# EAGLE design at91sam7x-ek (EAGLE 4.11)
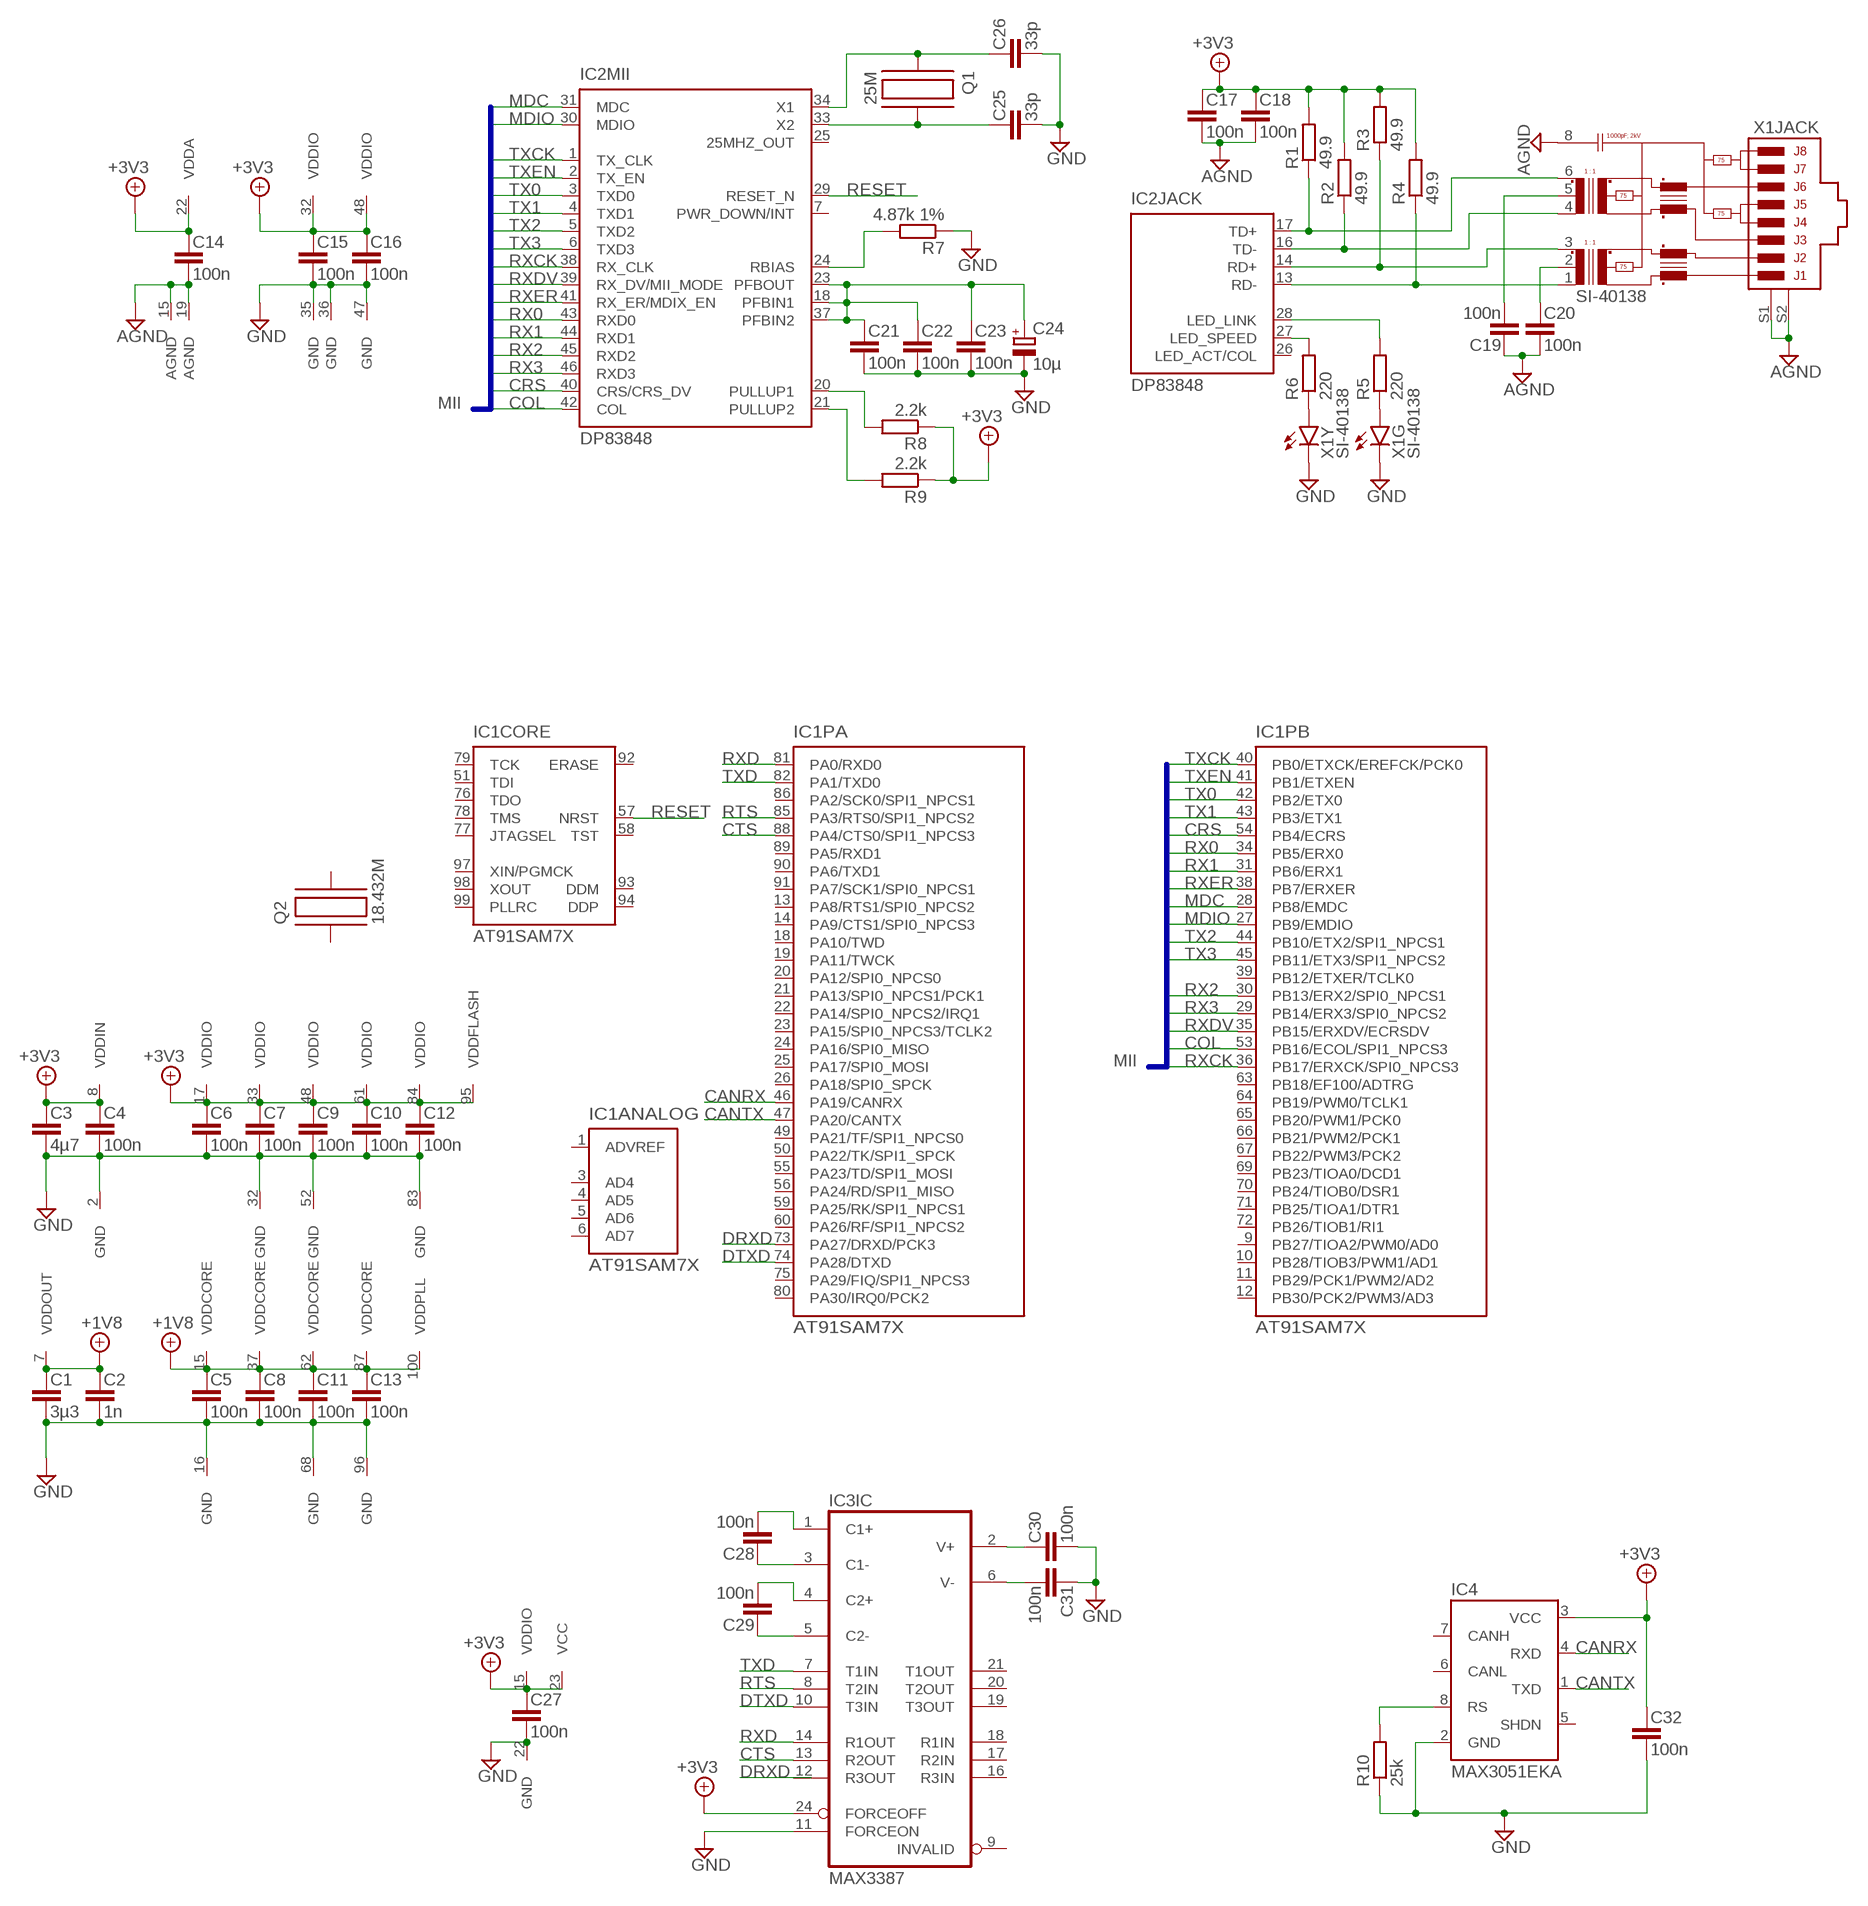
[diagram p0: schematic, sheet 1]

## Parts
C1  3µ3  C-EU  [C0603]
C2  1n  C-EU  [C0603]
C3  4µ7  C-EU  [C0603]
C4  100n  C-EU  [C0603]
C5  100n  C-EU  [C0603]
C6  100n  C-EU  [C0603]
C7  100n  C-EU  [C0603]
C8  100n  C-EU  [C0603]
C9  100n  C-EU  [C0603]
C10  100n  C-EU  [C0603]
C11  100n  C-EU  [C0603]
C12  100n  C-EU  [C0603]
C13  100n  C-EU  [C0603]
C14  100n  C-EU  [C0603]
C15  100n  C-EU  [C0603]
C16  100n  C-EU  [C0603]
C17  100n  C-EU  [C0603]
C18  100n  C-EU  [C0603]
C19  100n  C-EU  [C0603]
C20  100n  C-EU  [C0603]
C21  100n  C-EU  [C0603]
C22  100n  C-EU  [C0603]
C23  100n  C-EU  [C0603]
C24  10µ  CPOLCT3216  [CT3216]
C25  33p  C-EU  [C0603]
C26  33p  C-EU  [C0603]
C27  100n  C-EU  [C0603]
C28  100n  C-EU  [C0603]
C29  100n  C-EU  [C0603]
C30  100n  C-EU  [C0603]
C31  100n  C-EU  [C0603]
C32  100n  C-EU  [C0603]
IC1  AT91SAM7X  [LQFP100]
IC2  DP83848  [LQFP48]
IC3  MAX3387  [TSSOP24]
IC4  MAX3051EKA  [SOT23-8L]
Q1  25M  C-MAC-LFA147E  [SMD]
Q2  18.432M  C-MAC-LFA147E  [SMD]
R1  49.9  R-EU  [R0603]
R2  49.9  R-EU  [R0603]
R3  49.9  R-EU  [R0603]
R4  49.9  R-EU  [R0603]
R5  220  R-EU  [R0603]
R6  220  R-EU  [R0603]
R7  4.87k 1%  R-EU  [R0603]
R8  2.2k  R-EU  [R0603]
R9  2.2k  R-EU  [R0603]
R10  25k  R-EU  [R0603]
X1  SI-40138  [SI-40138]

## Nets
+1V8: C1.1 C2.1 C5.1 C8.1 C11.1 C13.1 IC1.7(VDDOUT) IC1.15(VDDCORE) IC1.37(VDDCORE) IC1.62(VDDCORE) IC1.87(VDDCORE) IC1.100(VDDPLL)
+3V3: C3.1 C4.1 C6.1 C7.1 C9.1 C10.1 C12.1 C14.1 C15.1 C16.1 C17.1 C18.1 C27.1 C32.1 IC1.8(VDDIN) IC1.17(VDDIO) IC1.33(VDDIO) IC1.48(VDDIO) IC1.61(VDDIO) IC1.84(VDDIO) IC1.95(VDDFLASH) IC2.22(VDDA) IC2.32(VDDIO) IC2.48(VDDIO) IC3.15(VDDIO) IC3.23(VCC) IC3.24(IC:FORCEOFF) IC4.3(VCC) R1.2 R2.2 R3.2 R4.2 R8.1 R9.1
AGND: C14.2 C17.2 C18.2 C19.1 C20.2 IC2.15(AGND) IC2.19(AGND) X1.8(JACK:GND) X1.S1(JACK:S1) X1.S2(JACK:S2)
CANRX: IC1.46(PA:PA19/CANRX) IC4.4(RXD)
CANTX: IC1.47(PA:PA20/CANTX) IC4.1(TXD)
COL: IC1.53(PB:PB16/ECOL/SPI1_NPCS3) IC2.42(MII:COL)
CRS: IC1.54(PB:PB4/ECRS) IC2.40(MII:CRS/CRS_DV)
CTS: IC1.88(PA:PA4/CTS0/SPI1_NPCS3) IC3.13(IC:R2OUT)
DRXD: IC1.73(PA:PA27/DRXD/PCK3)
DTXD: IC1.74(PA:PA28/DTXD) IC3.10(IC:T3IN)
GND: C1.2 C2.2 C3.2 C4.2 C5.2 C6.2 C7.2 C8.2 C9.2 C10.2 C11.2 C12.2 C13.2 C15.2 C16.2 C21.2 C22.2 C23.2 C24.- C25.2 C26.2 C27.2 C30.2 C31.1 C32.2 IC1.2(GND) IC1.16(GND) IC1.32(GND) IC1.52(GND) IC1.68(GND) IC1.83(GND) IC1.96(GND) IC2.35(GND) IC2.36(GND) IC2.47(GND) IC3.11(IC:FORCEON) IC3.22(GND) IC4.2(GND) R7.1 R10.1 X1.GC(G:C) X1.YC(Y:C)
MDC: IC1.28(PB:PB8/EMDC) IC2.31(MII:MDC)
MDIO: IC1.27(PB:PB9/EMDIO) IC2.30(MII:MDIO)
N$1: IC2.13(JACK:RD-) R4.1 X1.1(JACK:RD-)
N$2: IC2.14(JACK:RD+) R3.1 X1.3(JACK:RD+)
N$3: IC2.16(JACK:TD-) R2.1 X1.4(JACK:TD-)
N$4: IC2.17(JACK:TD+) R1.1 X1.6(JACK:TD+)
N$5: C20.1 X1.2(JACK:CTR)
N$6: C19.2 X1.5(JACK:CTT)
N$7: R6.1 X1.YA(Y:A)
N$8: IC2.27(JACK:LED_SPEED) R6.2
N$9: IC2.28(JACK:LED_LINK) R5.2
N$10: R5.1 X1.GA(G:A)
N$11: C21.1 C22.1 C23.1 C24.+ IC2.18(MII:PFBIN1) IC2.23(MII:PFBOUT) IC2.37(MII:PFBIN2)
N$12: C25.1 IC2.33(MII:X2) Q1.P$2
N$13: C26.1 IC2.34(MII:X1) Q1.P$1
N$14: IC2.24(MII:RBIAS) R7.2
N$15: IC2.20(MII:PULLUP1) R8.2
N$16: IC2.21(MII:PULLUP2) R9.2
N$17: C28.1 IC3.3(IC:C1-)
N$18: C28.2 IC3.1(IC:C1+)
N$19: C29.2 IC3.4(IC:C2+)
N$20: C29.1 IC3.5(IC:C2-)
N$21: C30.1 IC3.2(IC:V+)
N$22: C31.2 IC3.6(IC:V-)
N$24: IC4.8(RS) R10.2
RESET: IC1.57(CORE:NRST) IC2.29(MII:RESET_N)
RTS: IC1.85(PA:PA3/RTS0/SPI1_NPCS2) IC3.8(IC:T2IN)
RX0: IC1.34(PB:PB5/ERX0) IC2.43(MII:RXD0)
RX1: IC1.31(PB:PB6/ERX1) IC2.44(MII:RXD1)
RX2: IC1.30(PB:PB13/ERX2/SPI0_NPCS1) IC2.45(MII:RXD2)
RX3: IC1.29(PB:PB14/ERX3/SPI0_NPCS2) IC2.46(MII:RXD3)
RXCK: IC1.36(PB:PB17/ERXCK/SPI0_NPCS3) IC2.38(MII:RX_CLK)
RXD: IC1.81(PA:PA0/RXD0) IC3.14(IC:R1OUT)
RXDV: IC1.35(PB:PB15/ERXDV/ECRSDV) IC2.39(MII:RX_DV/MII_MODE)
RXER: IC1.38(PB:PB7/ERXER) IC2.41(MII:RX_ER/MDIX_EN)
TX0: IC1.42(PB:PB2/ETX0) IC2.3(MII:TXD0)
TX1: IC1.43(PB:PB3/ETX1) IC2.4(MII:TXD1)
TX2: IC1.44(PB:PB10/ETX2/SPI1_NPCS1) IC2.5(MII:TXD2)
TX3: IC1.45(PB:PB11/ETX3/SPI1_NPCS2) IC2.6(MII:TXD3)
TXCK: IC1.40(PB:PB0/ETXCK/EREFCK/PCK0) IC2.1(MII:TX_CLK)
TXD: IC1.82(PA:PA1/TXD0) IC3.7(IC:T1IN)
TXEN: IC1.41(PB:PB1/ETXEN) IC2.2(MII:TX_EN)
Unconnected: IC1.1(ANALOG:ADVREF) IC1.3(ANALOG:AD4) IC1.4(ANALOG:AD5) IC1.5(ANALOG:AD6) IC1.6(ANALOG:AD7) IC1.9(PB:PB27/TIOA2/PWM0/AD0) IC1.10(PB:PB28/TIOB3/PWM1/AD1) IC1.11(PB:PB29/PCK1/PWM2/AD2) IC1.12(PB:PB30/PCK2/PWM3/AD3) IC1.13(PA:PA8/RTS1/SPI0_NPCS2) IC1.14(PA:PA9/CTS1/SPI0_NPCS3) IC1.18(PA:PA10/TWD) IC1.19(PA:PA11/TWCK) IC1.20(PA:PA12/SPI0_NPCS0) IC1.21(PA:PA13/SPI0_NPCS1/PCK1) IC1.22(PA:PA14/SPI0_NPCS2/IRQ1) IC1.23(PA:PA15/SPI0_NPCS3/TCLK2) IC1.24(PA:PA16/SPI0_MISO) IC1.25(PA:PA17/SPI0_MOSI) IC1.26(PA:PA18/SPI0_SPCK) IC1.39(PB:PB12/ETXER/TCLK0) IC1.49(PA:PA21/TF/SPI1_NPCS0) IC1.50(PA:PA22/TK/SPI1_SPCK) IC1.51(CORE:TDI) IC1.55(PA:PA23/TD/SPI1_MOSI) IC1.56(PA:PA24/RD/SPI1_MISO) IC1.58(CORE:TST) IC1.59(PA:PA25/RK/SPI1_NPCS1) IC1.60(PA:PA26/RF/SPI1_NPCS2) IC1.63(PB:PB18/EF100/ADTRG) IC1.64(PB:PB19/PWM0/TCLK1) IC1.65(PB:PB20/PWM1/PCK0) IC1.66(PB:PB21/PWM2/PCK1) IC1.67(PB:PB22/PWM3/PCK2) IC1.69(PB:PB23/TIOA0/DCD1) IC1.70(PB:PB24/TIOB0/DSR1) IC1.71(PB:PB25/TIOA1/DTR1) IC1.72(PB:PB26/TIOB1/RI1) IC1.75(PA:PA29/FIQ/SPI1_NPCS3) IC1.76(CORE:TDO) IC1.77(CORE:JTAGSEL) IC1.78(CORE:TMS) IC1.79(CORE:TCK) IC1.80(PA:PA30/IRQ0/PCK2) IC1.86(PA:PA2/SCK0/SPI1_NPCS1) IC1.89(PA:PA5/RXD1) IC1.90(PA:PA6/TXD1) IC1.91(PA:PA7/SCK1/SPI0_NPCS1) IC1.92(CORE:ERASE) IC1.93(CORE:DDM) IC1.94(CORE:DDP) IC1.97(CORE:XIN/PGMCK) IC1.98(CORE:XOUT) IC1.99(CORE:PLLRC) IC2.7(MII:PWR_DOWN/INT) IC2.25(MII:25MHZ_OUT) IC2.26(JACK:LED_ACT/COL) IC3.9(IC:INVALID) IC3.12(IC:R3OUT) IC3.16(IC:R3IN) IC3.17(IC:R2IN) IC3.18(IC:R1IN) IC3.19(IC:T3OUT) IC3.20(IC:T2OUT) IC3.21(IC:T1OUT) IC4.5(SHDN) IC4.6(CANL) IC4.7(CANH) Q2.P$1 Q2.P$2

## Buses
MII:MDC,MDIO,TXCK,TXEN,TX[0..3],RXCK,RXDV,RXER,RX[0..3],CRS,COL

## Notes on the sheet
- MII
- MII

## Library data of the parts
C1-C23 C25-C32 = at91sam7x-ek:C-EU
C24 = at91sam7x-ek:CPOL
IC1 = at91sam7x-ek:AT91SAM7X
IC2 = at91sam7x-ek:DP83848
IC3 = at91sam7x-ek:MAX3387
IC4 = at91sam7x-ek:MAX3051
Q1 Q2 = at91sam7x-ek:C-MAC-LFA147E
R1-R10 = at91sam7x-ek:R-EU
X1 = at91sam7x-ek:SI-40138

## Board
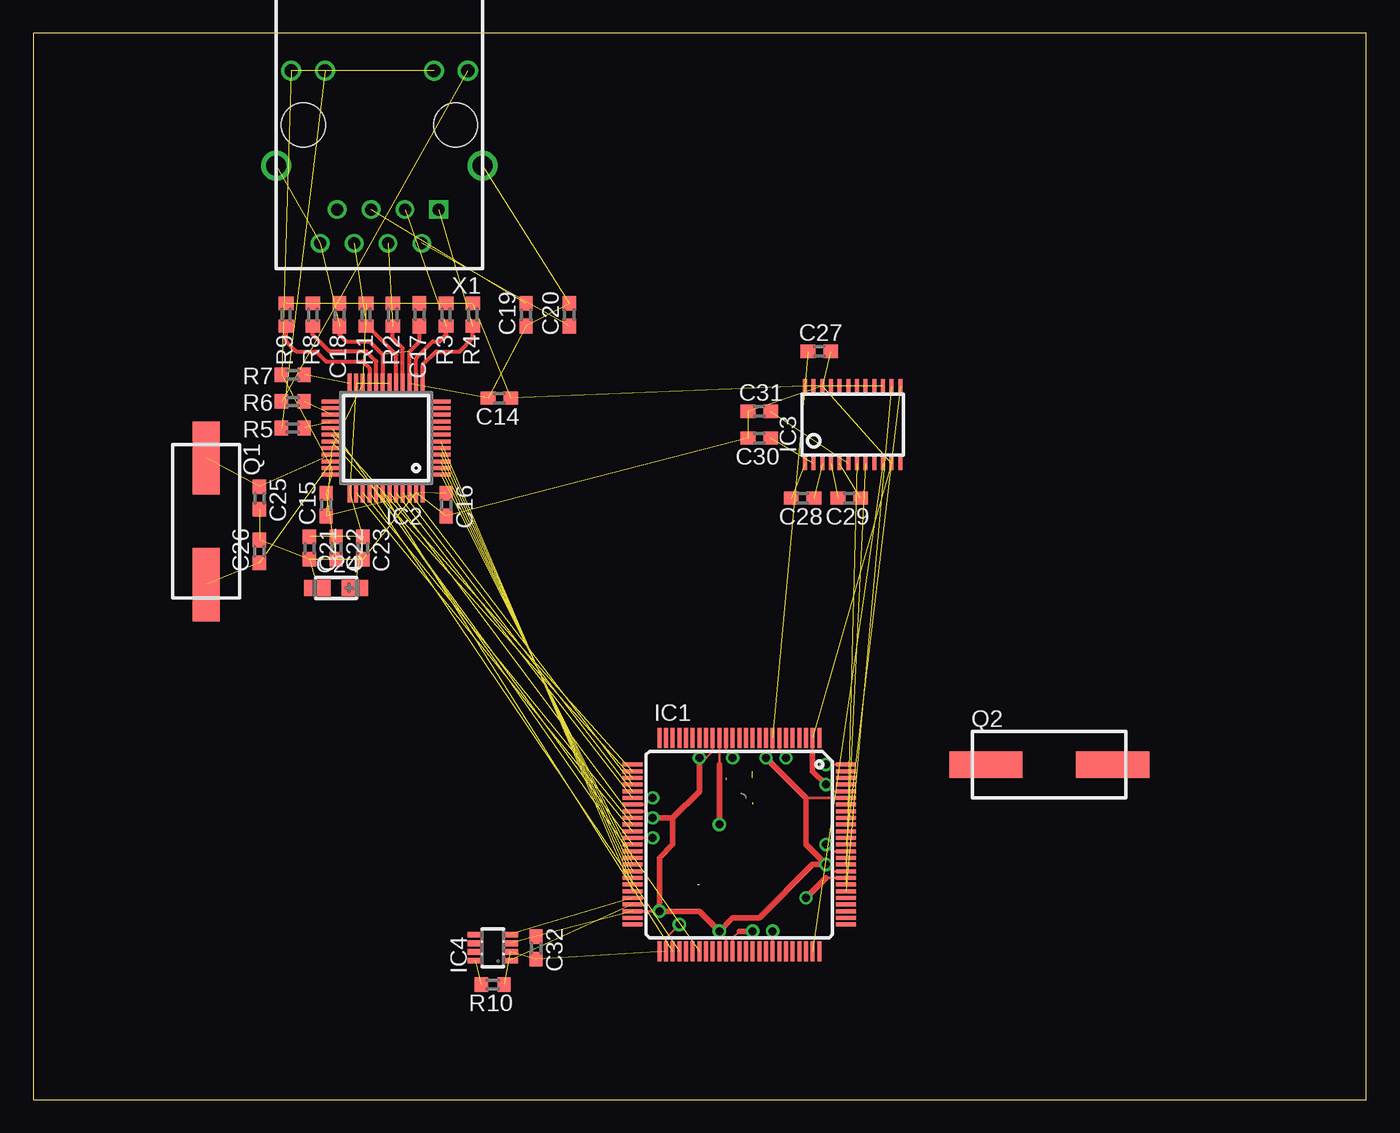
[diagram p1: board, top side]
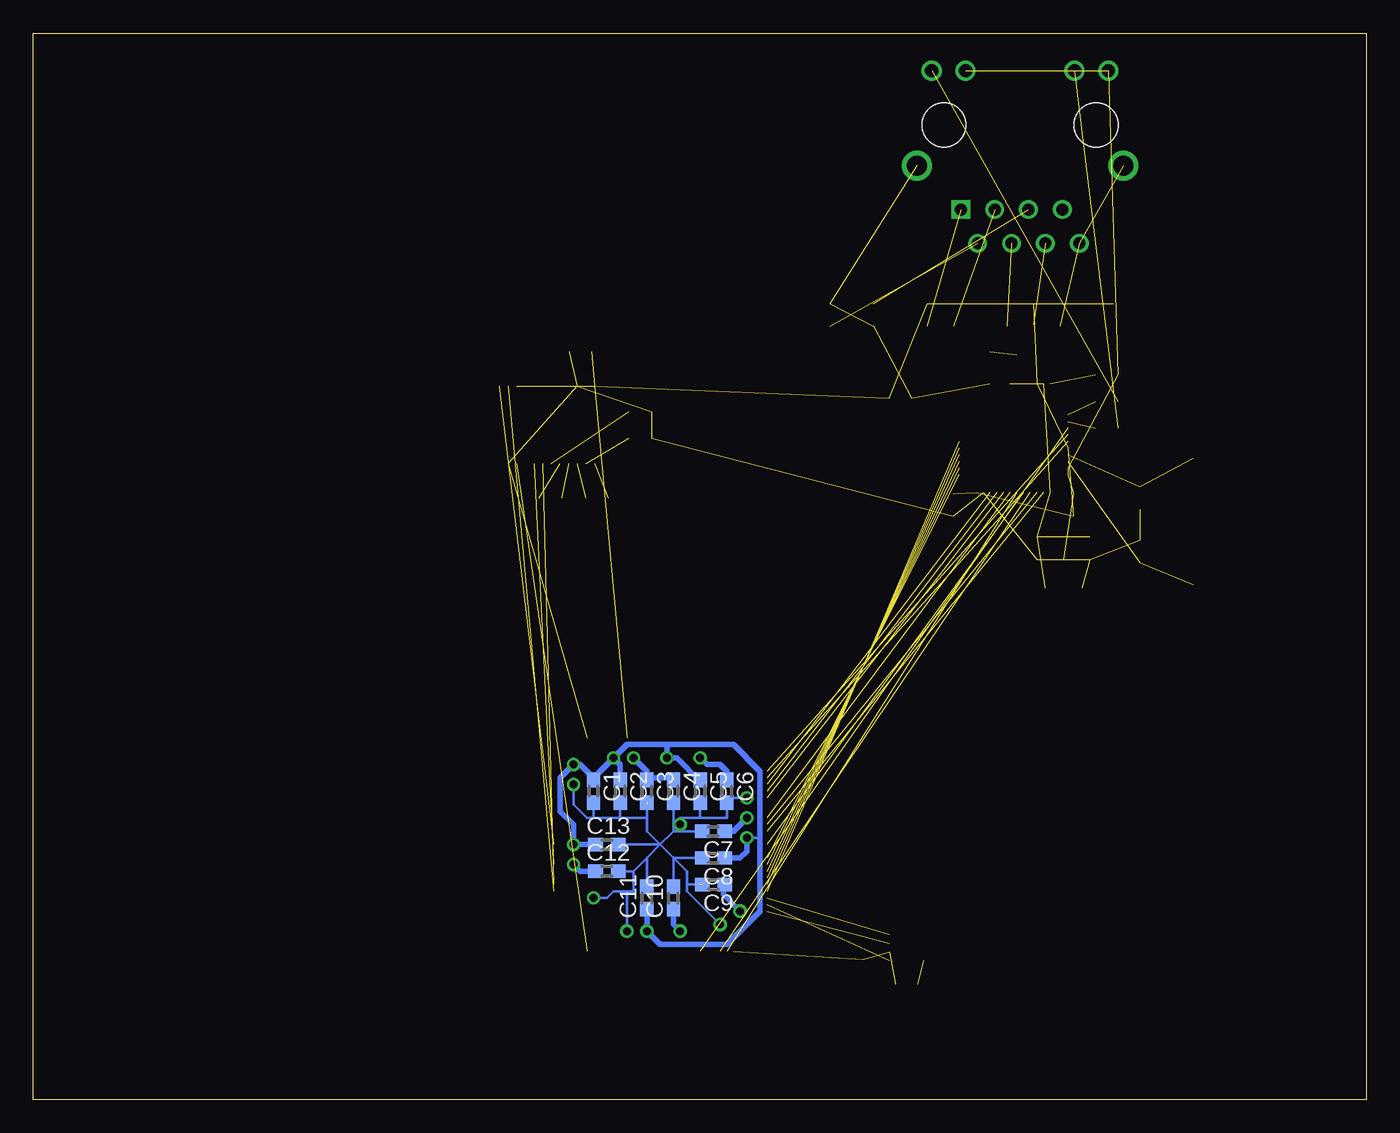
[diagram p2: board, bottom side, seen from below]

Size 100 x 80 mm. Coordinates in mm from the lower left corner, seen from the top.
Outline: 0,0 100,0 100,80 0,80 0,0
Copper layers (1*16): Top 0.035mm / dielectric 1.5mm / Bottom 0.035mm
Design rules "8mils": minimum track width 8mil, minimum drill 0.6mm, track to track 8mil, track to pad 8mil, pad to pad 8mil, via to via 8mil, smd to smd 8mil, copper to edge 10mil, drill to drill 10mil, minimum pad ring 10mil, minimum via ring 8mil, stop-mask expansion 0mil, vias tented up to drill 0mil, thermal gap 10mil

### Footprints (pad centres in the part's own frame; a part is rotated, then mirrored left to right if it is on the bottom)
C0603 = smd 1.1 x 1: 1 -0.85,0; 2 0.85,0
CT3216 = smd 2 x 1.2: + 1.4,0; - -1.4,0
LQFP100 = smd 0.297 x 1.5: 1 6,8; 2 5.5,8; 3 5,8; 4 4.5,8; 5 4,8; 6 3.5,8; 7 3,8; 8 2.5,8; 9 2,8; 10 1.5,8; 11 1,8; 12 0.5,8; 13 0,8; 14 -0.5,8; 15 -1,8; 16 -1.5,8; 17 -2,8; 18 -2.5,8; 19 -3,8; 20 -3.5,8; 21 -4,8; 22 -4.5,8; 23 -5,8; 24 -5.5,8; 25 -6,8; 51 -6,-8; 52 -5.5,-8; 53 -5,-8; 54 -4.5,-8; 55 -4,-8; 56 -3.5,-8; 57 -3,-8; 58 -2.5,-8; 59 -2,-8; 60 -1.5,-8; 61 -1,-8; 62 -0.5,-8; 63 0,-8; 64 0.5,-8; 65 1,-8; 66 1.5,-8; 67 2,-8; 68 2.5,-8; 69 3,-8; 70 3.5,-8; 71 4,-8; 72 4.5,-8; 73 5,-8; 74 5.5,-8; 75 6,-8 | smd 1.5 x 0.297: 26 -8,6; 27 -8,5.5; 28 -8,5; 29 -8,4.5; 30 -8,4; 31 -8,3.5; 32 -8,3; 33 -8,2.5; 34 -8,2; 35 -8,1.5; 36 -8,1; 37 -8,0.5; 38 -8,0; 39 -8,-0.5; 40 -8,-1; 41 -8,-1.5; 42 -8,-2; 43 -8,-2.5; 44 -8,-3; 45 -8,-3.5; 46 -8,-4; 47 -8,-4.5; 48 -8,-5; 49 -8,-5.5; 50 -8,-6; 76 8,-6; 77 8,-5.5; 78 8,-5; 79 8,-4.5; 80 8,-4; 81 8,-3.5; 82 8,-3; 83 8,-2.5; 84 8,-2; 85 8,-1.5; 86 8,-1; 87 8,-0.5; 88 8,0; 89 8,0.5; 90 8,1; 91 8,1.5; 92 8,2; 93 8,2.5; 94 8,3; 95 8,3.5; 96 8,4; 97 8,4.5; 98 8,5; 99 8,5.5; 100 8,6
LQFP48 = smd 1.5 x 0.297: 1 -4.1,2.75; 2 -4.1,2.25; 3 -4.1,1.75; 4 -4.1,1.25; 5 -4.1,0.75; 6 -4.1,0.25; 7 -4.1,-0.25; 8 -4.1,-0.75; 9 -4.1,-1.25; 10 -4.1,-1.75; 11 -4.1,-2.25; 12 -4.1,-2.75; 25 4.1,-2.75; 26 4.1,-2.25; 27 4.1,-1.75; 28 4.1,-1.25; 29 4.1,-0.75; 30 4.1,-0.25; 31 4.1,0.25; 32 4.1,0.75; 33 4.1,1.25; 34 4.1,1.75; 35 4.1,2.25; 36 4.1,2.75 | smd 0.297 x 1.5: 13 -2.75,-4.1; 14 -2.25,-4.1; 15 -1.75,-4.1; 16 -1.25,-4.1; 17 -0.75,-4.1; 18 -0.25,-4.1; 19 0.25,-4.1; 20 0.75,-4.1; 21 1.25,-4.1; 22 1.75,-4.1; 23 2.25,-4.1; 24 2.75,-4.1; 37 2.75,4.1; 38 2.25,4.1; 39 1.75,4.1; 40 1.25,4.1; 41 0.75,4.1; 42 0.25,4.1; 43 -0.25,4.1; 44 -0.75,4.1; 45 -1.25,4.1; 46 -1.75,4.1; 47 -2.25,4.1; 48 -2.75,4.1
TSSOP24 = smd 0.305 x 0.991: 1 -3.575,-2.918; 2 -2.925,-2.918; 3 -2.275,-2.918; 4 -1.625,-2.918; 5 -0.975,-2.918; 6 -0.325,-2.918; 7 0.325,-2.918; 8 0.975,-2.918; 9 1.625,-2.918; 10 2.275,-2.918; 11 2.925,-2.918; 12 3.575,-2.918; 13 3.575,2.918; 14 2.925,2.918; 15 2.275,2.918; 16 1.625,2.918; 17 0.975,2.918; 18 0.325,2.918; 19 -0.325,2.918; 20 -0.975,2.918; 21 -1.625,2.918; 22 -2.275,2.918; 23 -2.925,2.918; 24 -3.575,2.918
SOT23-8L = smd 0.44 x 1.2: 1 -0.95,-1.3; 2 -0.3,-1.3; 3 0.35,-1.3; 4 1,-1.3; 5 1,1.3; 6 0.35,1.3; 7 -0.3,1.3; 8 -0.95,1.3
SMD = smd 5.5 x 2: P$1 4.75,0; P$2 -4.75,0
R0603 = smd 1 x 1.1: 1 -0.85,0; 2 0.85,0
SI-40138 = drill 0.9 square: 1 -4.445,6.35 | drill 0.9 round: 2 -3.175,8.89; 3 -1.905,6.35; 4 -0.635,8.89; 5 0.635,6.35; 6 1.905,8.89; 7 3.175,6.35; 8 4.445,8.89 | drill 1 round: GA 4.089,-4.064; GC 6.629,-4.064; YA -6.629,-4.064; YC -4.089,-4.064 | drill 1.5 round: S1 -7.747,3.048; S2 7.747,3.048 | hole 3.3: -5.715,0; 5.715,0

### Placement (x,y rotation side)
C1  57.97,23.13 270 bottom
C2  55.97,23.13 270 bottom
C3  53.97,23.13 270 bottom
C4  51.97,23.13 270 bottom
C5  49.97,23.13 270 bottom
C6  47.97,23.13 270 bottom
C7  48.97,20.13 180 bottom
C8  48.97,18.13 180 bottom
C9  48.97,16.13 180 bottom
C10  51.97,15.13 90 bottom
C11  53.97,15.13 90 bottom
C12  56.97,17.13 0 bottom
C13  56.97,19.13 0 bottom
C14  34.97,52.63 180 top
C15  21.97,44.63 90 top
C16  30.97,44.63 270 top
C17  28.97,58.88 270 top
C18  22.97,58.88 270 top
C19  36.97,58.88 90 top
C20  40.22,58.88 90 top
C21  20.72,41.38 270 top
C22  22.72,41.38 270 top
C23  24.72,41.38 270 top
C24  22.72,38.38 0 top
C25  16.97,45.13 270 top
C26  16.97,41.13 90 top
C27  58.97,56.13 0 top
C28  57.72,45.13 180 top
C29  61.22,45.13 180 top
C30  54.47,49.63 180 top
C31  54.47,51.63 0 top
C32  37.72,11.38 270 top
IC1  52.97,19.13 0 top
IC2  26.47,49.63 180 top
IC3  61.47,50.63 0 top
IC4  34.47,11.38 90 top
Q1  12.97,43.38 270 top
Q2  76.22,25.13 0 top
R1  24.97,58.88 90 top
R2  26.97,58.88 90 top
R3  30.97,58.88 90 top
R4  32.97,58.88 90 top
R5  19.47,50.38 0 top
R6  19.47,52.38 0 top
R7  19.47,54.38 0 top
R8  20.97,58.88 270 top
R9  18.97,58.88 270 top
R10  34.47,8.63 180 top
X1  25.97,73.13 180 top

### Tracks (layer width: path | path; a pad name or v marks a point on that pad's centre or on a via)
+1V8  (via drill 0.6)
  Top 0.203: 52.97,12.63 52.47,12.13 IC1.62 | v46.47,19.63 IC1.37 | IC1.7 55.97,26.13 v56.47,25.63 | v52.47,25.63 51.97,26.13 IC1.15 | v59.47,19.13 59.97,18.63 IC1.87 | v59.47,25.13 IC1.100
  Top 0.406: v53.97,12.63 52.97,12.63
  Bottom 0.203: 57.97,24.13 C1.1 | 58.97,25.13 v59.47,25.13 | v46.47,19.63 | 45.47,19.63 v46.47,19.63
  Bottom 0.406: C11.1 v53.97,12.63 52.97,11.63 47.97,11.63 45.47,14.13 45.47,19.63 45.47,24.63 47.47,26.63 52.47,26.63 | C8.1 46.97,18.13 46.47,18.63 v46.47,19.63 | v56.47,25.63 55.97,25.13 C2.1 | v56.47,25.63 57.97,24.13 58.97,25.13 | C13.1 v59.47,19.13 59.47,20.63 60.47,21.63 60.47,24.13 v59.47,25.13 | 52.47,26.63 55.47,26.63 v56.47,25.63 | 52.47,26.63 v52.47,25.63 51.72,25.63 49.97,23.88 C5.1
+3V3  (via drill 0.6)  (22 unrouted)
  Top 0.203: v51.47,12.63 51.97,12.13 IC1.61 | IC1.48 v46.97,14.13 | IC1.33 45.97,21.63 v46.47,21.13 | v54.97,25.63 55.47,26.13 IC1.8 | IC1.17 50.97,26.13 50.47,25.63 v49.97,25.63 | v59.47,17.63 59.97,17.13 IC1.84 | 57.97,22.63 IC1.95
  Top 0.406: v54.97,25.63 57.97,22.63 57.97,19.13 v59.47,17.63 58.47,17.63 54.47,13.63 52.47,13.63 v51.47,12.63 49.97,14.13 v46.97,14.13 46.97,18.13 47.97,19.13 47.97,21.13 | 47.97,21.13 v46.47,21.13 | v49.97,25.63 49.97,23.13 47.97,21.13
  Bottom 0.203: 47.47,20.13 C7.1 | 53.97,24.13 C3.1 | 47.97,24.63 C6.1
  Bottom 0.406: C10.1 51.97,13.13 v51.47,12.63 | v46.47,21.13 47.47,20.13 | v54.97,25.63 53.97,24.63 | 47.97,24.63 48.47,25.13 49.47,25.13 v49.97,25.63 | C12.1 58.97,17.13 v59.47,17.63 | v46.97,14.13 48.22,15.38 48.22,16.13 C9.1 | 51.97,24.13 53.97,24.13
AGND  (7 unrouted)
  Top 0.3: IC2.19 26.22,55.88 25.22,56.88 23.47,56.88 22.97,57.38 C18.2 | IC2.15 28.22,56.13 28.97,56.88 C17.2
CANRX  (1 unrouted)
CANTX  (1 unrouted)
COL  (1 unrouted)
CRS  (1 unrouted)
CTS  (1 unrouted)
DTXD  (1 unrouted)
GND  (via drill 0.6)  (24 unrouted)
  Top 0.203: IC1.52 47.47,12.13 v48.47,13.13 | v55.47,12.63 IC1.68 | 59.47,16.63 IC1.83 | IC1.96 59.97,23.13 v59.47,23.63 | 58.47,26.13 IC1.2 | v46.47,22.63 45.97,22.13 IC1.32 | 51.47,25.13 IC1.16
  Top 0.406: v57.97,15.13 59.47,16.63 | 58.47,26.13 58.47,24.63 v59.47,23.63 | v51.47,20.63 51.47,25.13
  Bottom 0.203: 51.97,18.13 C8.2 | 51.97,20.13 C7.2 | 49.97,21.13 47.97,21.13 C6.2 47.97,22.63 v46.47,22.63 | 51.97,20.13 51.97,20.63 | 51.97,20.63 C4.2 | 52.97,19.13 51.97,20.13 | 53.97,21.13 53.97,20.13 52.97,19.13 | 53.97,21.13 53.97,22.13 | 52.97,19.13 C13.2 | 54.97,17.13 C12.2 | 53.97,18.13 54.97,17.13 | 53.97,18.13 C11.2 | 52.97,19.13 53.97,18.13 | 51.97,18.13 C10.2 | 50.97,16.13 49.97,16.13 | 50.97,16.13 50.97,17.13 51.97,18.13 | 51.97,18.13 52.97,19.13 | v48.47,13.13 50.97,15.63 50.97,16.13 | v57.97,15.13 56.97,15.13 56.47,15.63 55.47,15.63 | v59.47,23.63 59.47,22.13 58.47,21.13 57.97,21.13 | 51.97,20.63 v51.47,20.63 51.47,21.13 49.97,21.13 | 49.97,21.13 C5.2 | 55.47,15.63 v55.47,12.63 | 55.47,15.63 54.97,15.63 54.97,17.13 | 57.97,21.13 C1.2 | 53.97,21.13 55.97,21.13 | 55.97,21.13 57.97,21.13 | 55.97,22.38 C2.2 55.97,21.13
MDC  (1 unrouted)
MDIO  (1 unrouted)
N$1  (1 unrouted)
  Top 0.3: IC2.13 29.22,55.13 30.22,56.13 31.97,56.13 32.97,57.13 R4.1
N$2  (1 unrouted)
  Top 0.3: IC2.14 28.72,55.63 29.97,56.88 30.47,56.88 30.97,57.38 R3.1
N$3  (1 unrouted)
  Top 0.3: IC2.16 27.72,56.38 26.97,57.13 R2.1
N$4  (1 unrouted)
  Top 0.3: R1.1 24.97,58.13 27.22,55.88 IC2.17
N$5  (1 unrouted)
N$6  (1 unrouted)
N$7  (1 unrouted)
N$8  (1 unrouted)
N$9  (1 unrouted)
N$10  (1 unrouted)
N$11  (6 unrouted)
N$12  (2 unrouted)
N$13  (2 unrouted)
N$14  (1 unrouted)
N$15
  Top 0.3: IC2.20 25.72,55.38 24.97,56.13 22.22,56.13 20.97,57.38 R8.2
N$16
  Top 0.3: IC2.21 25.22,54.88 24.72,55.38 21.97,55.38 21.22,56.13 19.72,56.13 18.97,56.88 R9.2
N$17  (1 unrouted)
N$18  (1 unrouted)
N$19  (1 unrouted)
N$20  (1 unrouted)
N$21  (1 unrouted)
N$22  (1 unrouted)
N$24  (1 unrouted)
RESET  (1 unrouted)
RTS  (1 unrouted)
RX0  (1 unrouted)
RX1  (1 unrouted)
RX2  (1 unrouted)
RX3  (1 unrouted)
RXCK  (1 unrouted)
RXD  (1 unrouted)
RXDV  (1 unrouted)
RXER  (1 unrouted)
TX0  (1 unrouted)
TX1  (1 unrouted)
TX2  (1 unrouted)
TX3  (1 unrouted)
TXCK  (1 unrouted)
TXD  (1 unrouted)
TXEN  (1 unrouted)